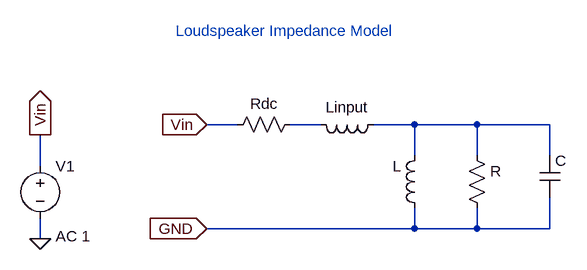
[diagram p0: schematic loudspeaker_model.asc]
loudspeaker_model.asc, the LTspice schematic file:
Version 4
SHEET 1 880 680
WIRE 48 80 0 80
WIRE 176 80 128 80
WIRE 320 80 256 80
WIRE 416 80 320 80
WIRE 528 80 416 80
WIRE 320 128 320 80
WIRE 416 128 416 80
WIRE 528 128 528 80
WIRE -256 144 -256 96
WIRE 320 240 320 208
WIRE 320 240 0 240
WIRE 416 240 416 208
WIRE 416 240 320 240
WIRE 528 240 528 192
WIRE 528 240 416 240
WIRE -256 256 -256 224
FLAG 0 80 Vin
IOPIN 0 80 In
FLAG 0 240 GND
IOPIN 0 240 In
FLAG -256 256 0
FLAG -256 96 Vin
IOPIN -256 96 Out
SYMBOL res 144 64 R90
WINDOW 0 0 56 VBottom 2
WINDOW 3 32 56 VTop 2
SYMATTR InstName Rdc
SYMATTR Value ""
SYMBOL ind 272 64 R90
WINDOW 0 5 56 VBottom 2
WINDOW 3 32 56 VTop 2
SYMATTR InstName Linput
SYMATTR Value ""
SYMBOL ind 336 224 R180
WINDOW 0 36 80 Left 2
WINDOW 3 36 40 Left 2
SYMATTR InstName L
SYMATTR Value ""
SYMBOL res 400 112 R0
SYMATTR InstName R
SYMATTR Value ""
SYMBOL cap 512 128 R0
SYMATTR InstName C
SYMATTR Value ""
SYMBOL voltage -256 128 R0
WINDOW 123 24 124 Left 2
WINDOW 39 0 0 Left 0
SYMATTR InstName V1
SYMATTR Value ""
SYMATTR Value2 AC 1
TEXT -48 -64 Left 2 ;Loudspeaker Impedance Model

The netlist it stands for:
* loudspeaker_model.asc
Rdc N001 Vin
Linput N002 N001
L GND N002
R N002 GND
C N002 GND
V1 Vin 0 AC 1
* Loudspeaker Impedance Model
.backanno
.end